# EAGLE schematic RoboDiscovery-F4_V1.0 (EAGLE 6.5.0)

## Sheet 1 of 6
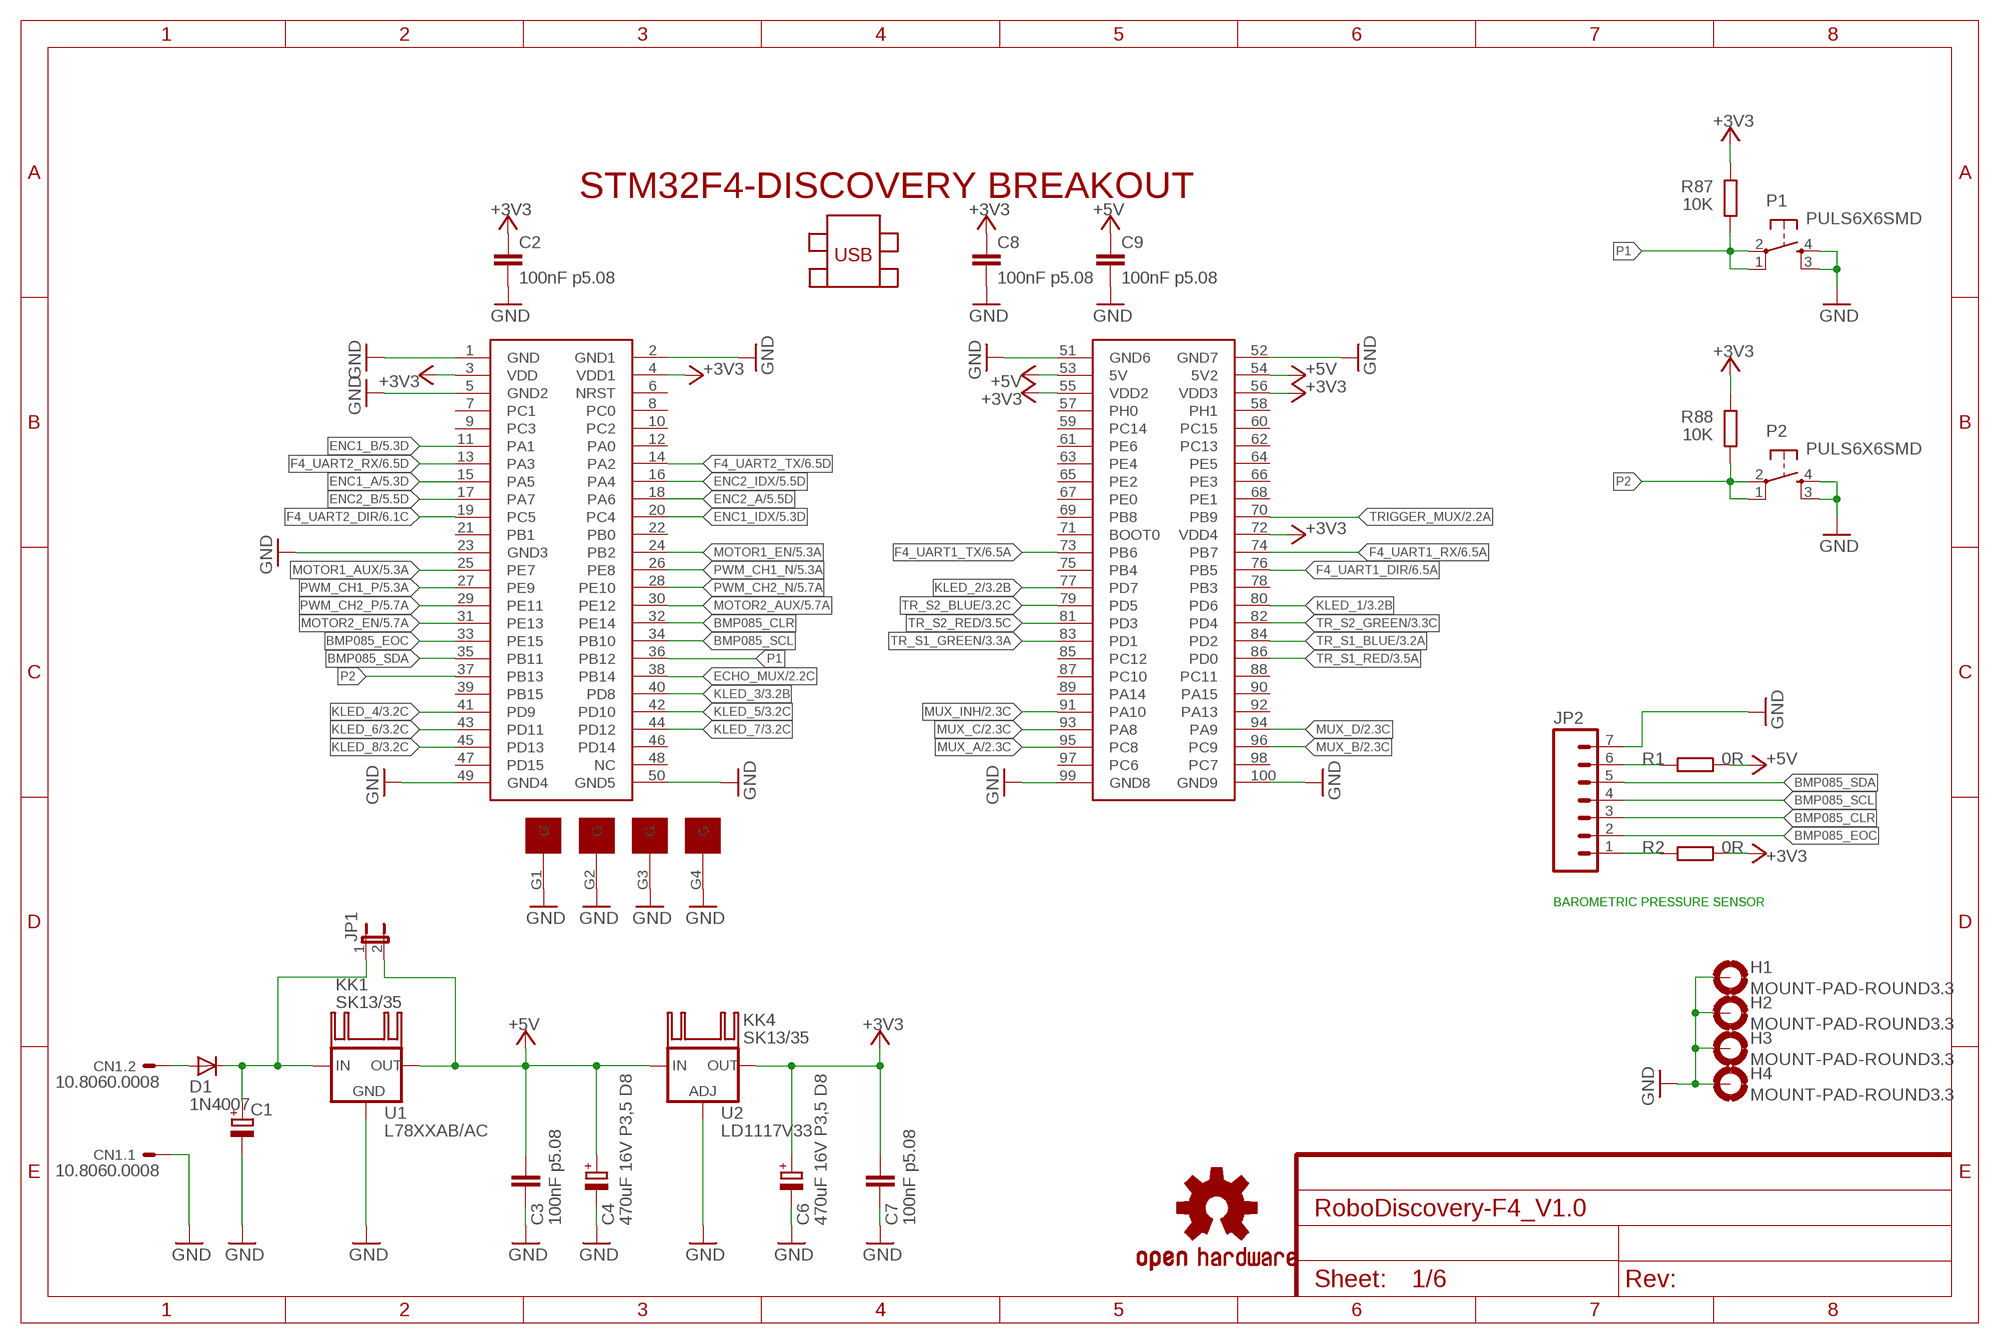
[diagram p0: schematic, sheet 1]
FRAME1 (FRAME-A4L): CNAME: CPU; CREVISION: 0.1; DESIGNER: Mauro Soligo

### Parts
C1  CPOL-EUE5-13  [E5-13]
C2  100nF p5.08  C-EU050-024X044  [C050-024X044]
C3  100nF p5.08  C-EU050-024X044  [C050-024X044]
C4  470uF 16V P3,5 D8  CPOL-EUE3.5-8  [E3,5-8]
C6  470uF 16V P3,5 D8  CPOL-EUE3.5-8  [E3,5-8]
C7  100nF p5.08  C-EU050-024X044  [C050-024X044]
C8  100nF p5.08  C-EU050-024X044  [C050-024X044]
C9  100nF p5.08  C-EU050-024X044  [C050-024X044]
CN1  10.8060.0008  [300-021-13_2P/5VE]
D1  1N4007  [D041-10]
DIS1  STM32F4-DISCOVERY  [STM32F4-DISCOVERY]
H1  MOUNT-PAD-ROUND3.3  [3,3-PAD]
H2  MOUNT-PAD-ROUND3.3  [3,3-PAD]
H3  MOUNT-PAD-ROUND3.3  [3,3-PAD]
H4  MOUNT-PAD-ROUND3.3  [3,3-PAD]
JP1  JP1E  [JP1]
JP2  M07LONGPADS  [1X07_LONGPADS]
KK1  SK13/35  [SK13/35]
KK4  SK13/35  [SK13/35]
LOGO1  OSHW-LOGOM  [OSHW-LOGO-M]
P1  PULS6X6SMD  [PULS6X6SMD]
P2  PULS6X6SMD  [PULS6X6SMD]
R1  0R  R-EU_0207/7  [0207/7]
R2  0R  R-EU_0207/7  [0207/7]
R87  10K  R-EU_0207/7  [0207/7]
R88  10K  R-EU_0207/7  [0207/7]
U1  L78XXAB/AC  [78XXL]
U2  LD1117V33  LM317TL  [317TL]

### Nets
+3V3: C2.1 C6.+ C7.1 C8.1 DIS1.3(VDD) DIS1.4(VDD1) DIS1.55(VDD2) DIS1.56(VDD3) DIS1.72(VDD4) R2.1 R87.1 R88.1 U2.2(OUT) ; also sheet 5,6
+5V: C3.1 C4.+ C9.1 DIS1.53(5V) DIS1.54(5V2) JP1.2 R1.1 U1.OUT U2.3(IN) ; also sheet 2,5,6
BMP085_CLR: DIS1.32(PE14) JP2.3
BMP085_EOC: DIS1.33(PE15) JP2.2
BMP085_SCL: DIS1.34(PB10) JP2.4
BMP085_SDA: DIS1.35(PB11) JP2.5
ECHO_MUX: DIS1.38(PB14) ; also sheet 2,4
ENC1_A: DIS1.15(PA5) ; also sheet 5
ENC1_B: DIS1.11(PA1) ; also sheet 5
ENC1_IDX: DIS1.20(PC4) ; also sheet 5
ENC2_A: DIS1.18(PA6) ; also sheet 5
ENC2_B: DIS1.17(PA7) ; also sheet 5
ENC2_IDX: DIS1.16(PA4) ; also sheet 5
F4_UART1_DIR: DIS1.76(PB5) ; also sheet 6
F4_UART1_RX: DIS1.74(PB7) ; also sheet 6
F4_UART1_TX: DIS1.73(PB6) ; also sheet 6
F4_UART2_DIR: DIS1.19(PC5) ; also sheet 6
F4_UART2_RX: DIS1.13(PA3) ; also sheet 6
F4_UART2_TX: DIS1.14(PA2) ; also sheet 6
GND: C1.- C2.2 C3.2 C4.- C6.- C7.2 C8.2 C9.2 CN1.1 DIS1.1(GND) DIS1.2(GND1) DIS1.5(GND2) DIS1.23(GND3) DIS1.49(GND4) DIS1.50(GND5) DIS1.51(GND6) DIS1.52(GND7) DIS1.99(GND8) DIS1.100(GND9) DIS1.G1(G) DIS1.G2(G) DIS1.G3(G) DIS1.G4(G) H1.B3,3(MOUNT) H2.B3,3(MOUNT) H3.B3,3(MOUNT) H4.B3,3(MOUNT) JP2.7 P1.3(S1) P1.4(S) P2.3(S1) P2.4(S) U1.GND U2.1(ADJ) ; also sheet 2,3,4,5,6
KLED_1: DIS1.80(PD6) ; also sheet 3
KLED_2: DIS1.77(PD7) ; also sheet 3
KLED_3: DIS1.40(PD8) ; also sheet 3
KLED_4: DIS1.41(PD9) ; also sheet 3
KLED_5: DIS1.42(PD10) ; also sheet 3
KLED_6: DIS1.43(PD11) ; also sheet 3
KLED_7: DIS1.44(PD12) ; also sheet 3
KLED_8: DIS1.45(PD13) ; also sheet 3
MOTOR1_AUX: DIS1.25(PE7) ; also sheet 5
MOTOR1_EN: DIS1.24(PB2) ; also sheet 5
MOTOR2_AUX: DIS1.30(PE12) ; also sheet 5
MOTOR2_EN: DIS1.31(PE13) ; also sheet 5
MUX_A: DIS1.95(PC8) ; also sheet 2,4
MUX_B: DIS1.96(PC9) ; also sheet 2,4
MUX_C: DIS1.93(PA8) ; also sheet 2,4
MUX_D: DIS1.94(PA9) ; also sheet 2,4
MUX_INH: DIS1.91(PA10) ; also sheet 2,4
N$71: C1.+ D1.C JP1.1 U1.IN
N$73: JP2.6 R1.2
N$74: JP2.1 R2.2
N$102: CN1.2 D1.A
P1: DIS1.36(PB12) P1.1 P1.2(P) R87.2
P2: DIS1.37(PB13) P2.1 P2.2(P) R88.2
PWM_CH1_N: DIS1.26(PE8) ; also sheet 5
PWM_CH1_P: DIS1.27(PE9) ; also sheet 5
PWM_CH2_N: DIS1.28(PE10) ; also sheet 5
PWM_CH2_P: DIS1.29(PE11) ; also sheet 5
TR_S1_BLUE: DIS1.84(PD2) ; also sheet 3
TR_S1_GREEN: DIS1.83(PD1) ; also sheet 3
TR_S1_RED: DIS1.86(PD0) ; also sheet 3
TR_S2_BLUE: DIS1.79(PD5) ; also sheet 3
TR_S2_GREEN: DIS1.82(PD4) ; also sheet 3
TR_S2_RED: DIS1.81(PD3) ; also sheet 3
TRIGGER_MUX: DIS1.70(PB9) ; also sheet 2,4
Unconnected: DIS1.6(NRST) DIS1.7(PC1) DIS1.8(PC0) DIS1.9(PC3) DIS1.10(PC2) DIS1.12(PA0) DIS1.21(PB1) DIS1.22(PB0) DIS1.39(PB15) DIS1.46(PD14) DIS1.47(PD15) DIS1.48(NC) DIS1.57(PH0) DIS1.58(PH1) DIS1.59(PC14) DIS1.60(PC15) DIS1.61(PE6) DIS1.62(PC13) DIS1.63(PE4) DIS1.64(PE5) DIS1.65(PE2) DIS1.66(PE3) DIS1.67(PE0) DIS1.68(PE1) DIS1.69(PB8) DIS1.71(BOOT0) DIS1.75(PB4) DIS1.78(PB3) DIS1.85(PC12) DIS1.87(PC10) DIS1.88(PC11) DIS1.89(PA14) DIS1.90(PA15) DIS1.92(PA13) DIS1.97(PC6) DIS1.98(PC7)

### Notes on the sheet
- BAROMETRIC PRESSURE SENSOR

## Sheet 2 of 6
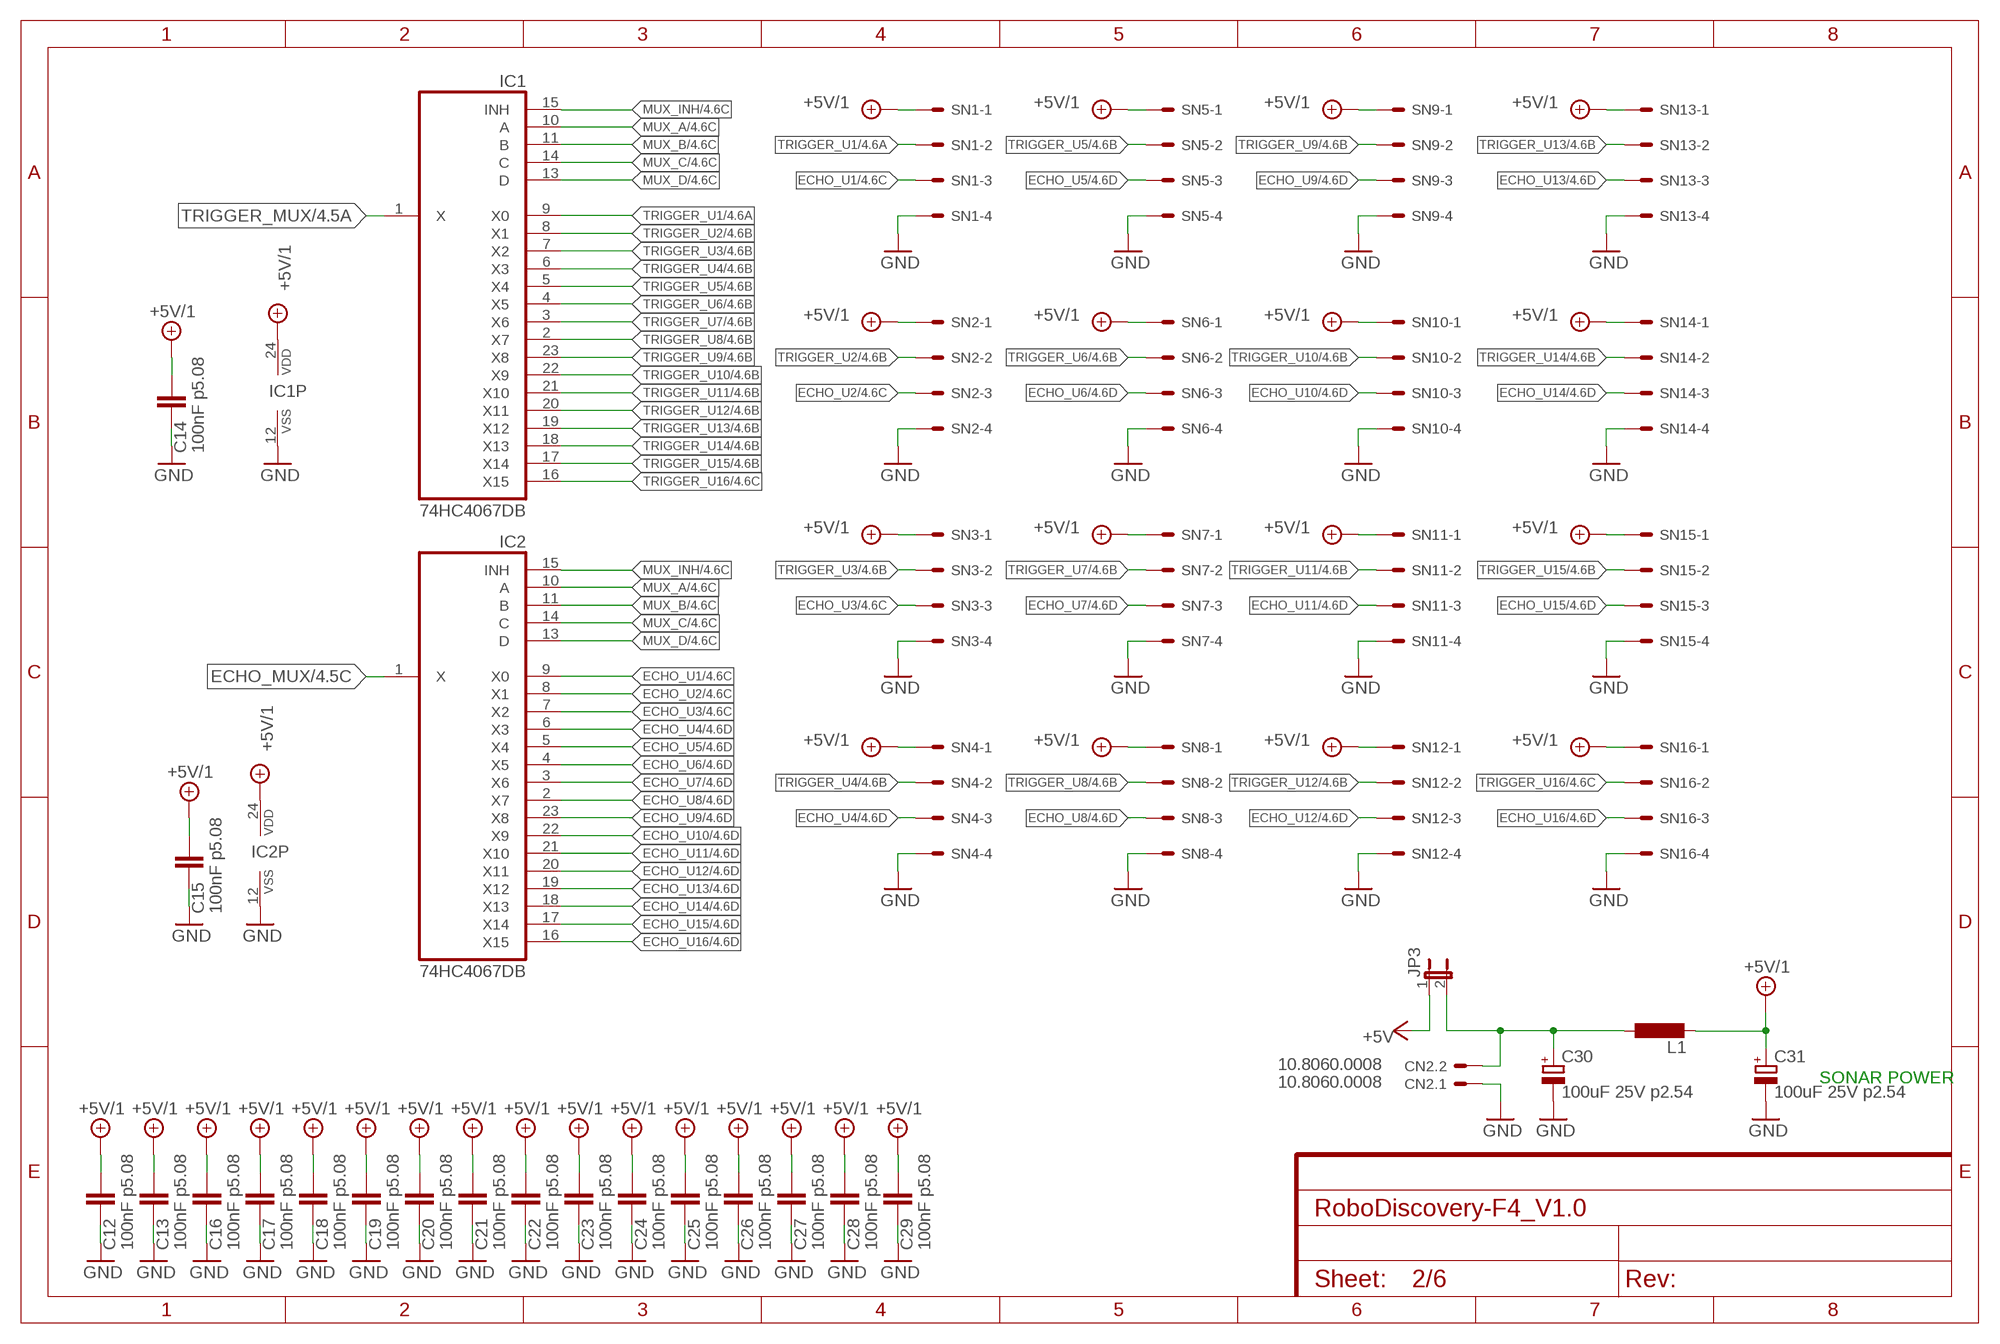
[diagram p1: schematic, sheet 2]
FRAME2 (FRAME-A4L): CNAME: SONAR MUX

### Parts
C12  100nF p5.08  C-EU050-024X044  [C050-024X044]
C13  100nF p5.08  C-EU050-024X044  [C050-024X044]
C14  100nF p5.08  C-EU050-024X044  [C050-024X044]
C15  100nF p5.08  C-EU050-024X044  [C050-024X044]
C16  100nF p5.08  C-EU050-024X044  [C050-024X044]
C17  100nF p5.08  C-EU050-024X044  [C050-024X044]
C18  100nF p5.08  C-EU050-024X044  [C050-024X044]
C19  100nF p5.08  C-EU050-024X044  [C050-024X044]
C20  100nF p5.08  C-EU050-024X044  [C050-024X044]
C21  100nF p5.08  C-EU050-024X044  [C050-024X044]
C22  100nF p5.08  C-EU050-024X044  [C050-024X044]
C23  100nF p5.08  C-EU050-024X044  [C050-024X044]
C24  100nF p5.08  C-EU050-024X044  [C050-024X044]
C25  100nF p5.08  C-EU050-024X044  [C050-024X044]
C26  100nF p5.08  C-EU050-024X044  [C050-024X044]
C27  100nF p5.08  C-EU050-024X044  [C050-024X044]
C28  100nF p5.08  C-EU050-024X044  [C050-024X044]
C29  100nF p5.08  C-EU050-024X044  [C050-024X044]
C30  100uF 25V p2.54  CPOL-EUE2.5-6  [E2,5-6]
C31  100uF 25V p2.54  CPOL-EUE2.5-6  [E2,5-6]
CN2  10.8060.0008  [300-021-13_2P/5VE]
IC1  74HC4067DB  4067D  [SO24W]
IC2  74HC4067DB  4067D  [SO24W]
JP3  JP1E  [JP1]
L1  L-EU2200-12.7  [2200-12.7]
SN1  22-27-2041-04  [6410-04]
SN2  22-27-2041-04  [6410-04]
SN3  22-27-2041-04  [6410-04]
SN4  22-27-2041-04  [6410-04]
SN5  22-27-2041-04  [6410-04]
SN6  22-27-2041-04  [6410-04]
SN7  22-27-2041-04  [6410-04]
SN8  22-27-2041-04  [6410-04]
SN9  22-27-2041-04  [6410-04]
SN10  22-27-2041-04  [6410-04]
SN11  22-27-2041-04  [6410-04]
SN12  22-27-2041-04  [6410-04]
SN13  22-27-2041-04  [6410-04]
SN14  22-27-2041-04  [6410-04]
SN15  22-27-2041-04  [6410-04]
SN16  22-27-2041-04  [6410-04]

### Nets
+5V: JP3.1 ; also sheet 1,5,6
+5V/1: C12.1 C13.1 C14.1 C15.1 C16.1 C17.1 C18.1 C19.1 C20.1 C21.1 C22.1 C23.1 C24.1 C25.1 C26.1 C27.1 C28.1 C29.1 C31.+ IC1.24(VDD) IC2.24(VDD) L1.2 SN1.1 SN2.1 SN3.1 SN4.1 SN5.1 SN6.1 SN7.1 SN8.1 SN9.1 SN10.1 SN11.1 SN12.1 SN13.1 SN14.1 SN15.1 SN16.1 ; also sheet 3,4,5
ECHO_MUX: IC2.1(X) ; also sheet 1,4
ECHO_U1: IC2.9(X0) SN1.3 ; also sheet 4
ECHO_U2: IC2.8(X1) SN2.3 ; also sheet 4
ECHO_U3: IC2.7(X2) SN3.3 ; also sheet 4
ECHO_U4: IC2.6(X3) SN4.3 ; also sheet 4
ECHO_U5: IC2.5(X4) SN5.3 ; also sheet 4
ECHO_U6: IC2.4(X5) SN6.3 ; also sheet 4
ECHO_U7: IC2.3(X6) SN7.3 ; also sheet 4
ECHO_U8: IC2.2(X7) SN8.3 ; also sheet 4
ECHO_U9: IC2.23(X8) SN9.3 ; also sheet 4
ECHO_U10: IC2.22(X9) SN10.3 ; also sheet 4
ECHO_U11: IC2.21(X10) SN11.3 ; also sheet 4
ECHO_U12: IC2.20(X11) SN12.3 ; also sheet 4
ECHO_U13: IC2.19(X12) SN13.3 ; also sheet 4
ECHO_U14: IC2.18(X13) SN14.3 ; also sheet 4
ECHO_U15: IC2.17(X14) SN15.3 ; also sheet 4
ECHO_U16: IC2.16(X15) SN16.3 ; also sheet 4
GND: C12.2 C13.2 C14.2 C15.2 C16.2 C17.2 C18.2 C19.2 C20.2 C21.2 C22.2 C23.2 C24.2 C25.2 C26.2 C27.2 C28.2 C29.2 C30.- C31.- CN2.1 IC1.12(VSS) IC2.12(VSS) SN1.4 SN2.4 SN3.4 SN4.4 SN5.4 SN6.4 SN7.4 SN8.4 SN9.4 SN10.4 SN11.4 SN12.4 SN13.4 SN14.4 SN15.4 SN16.4 ; also sheet 1,3,4,5,6
MUX_A: IC1.10(A) IC2.10(A) ; also sheet 1,4
MUX_B: IC1.11(B) IC2.11(B) ; also sheet 1,4
MUX_C: IC1.14(C) IC2.14(C) ; also sheet 1,4
MUX_D: IC1.13(D) IC2.13(D) ; also sheet 1,4
MUX_INH: IC1.15(INH) IC2.15(INH) ; also sheet 1,4
N$1: C30.+ CN2.2 JP3.2 L1.1
TRIGGER_MUX: IC1.1(X) ; also sheet 1,4
TRIGGER_U1: IC1.9(X0) SN1.2 ; also sheet 4
TRIGGER_U2: IC1.8(X1) SN2.2 ; also sheet 4
TRIGGER_U3: IC1.7(X2) SN3.2 ; also sheet 4
TRIGGER_U4: IC1.6(X3) SN4.2 ; also sheet 4
TRIGGER_U5: IC1.5(X4) SN5.2 ; also sheet 4
TRIGGER_U6: IC1.4(X5) SN6.2 ; also sheet 4
TRIGGER_U7: IC1.3(X6) SN7.2 ; also sheet 4
TRIGGER_U8: IC1.2(X7) SN8.2 ; also sheet 4
TRIGGER_U9: IC1.23(X8) SN9.2 ; also sheet 4
TRIGGER_U10: IC1.22(X9) SN10.2 ; also sheet 4
TRIGGER_U11: IC1.21(X10) SN11.2 ; also sheet 4
TRIGGER_U12: IC1.20(X11) SN12.2 ; also sheet 4
TRIGGER_U13: IC1.19(X12) SN13.2 ; also sheet 4
TRIGGER_U14: IC1.18(X13) SN14.2 ; also sheet 4
TRIGGER_U15: IC1.17(X14) SN15.2 ; also sheet 4
TRIGGER_U16: IC1.16(X15) SN16.2 ; also sheet 4

### Notes on the sheet
- SONAR POWER

## Sheet 3 of 6
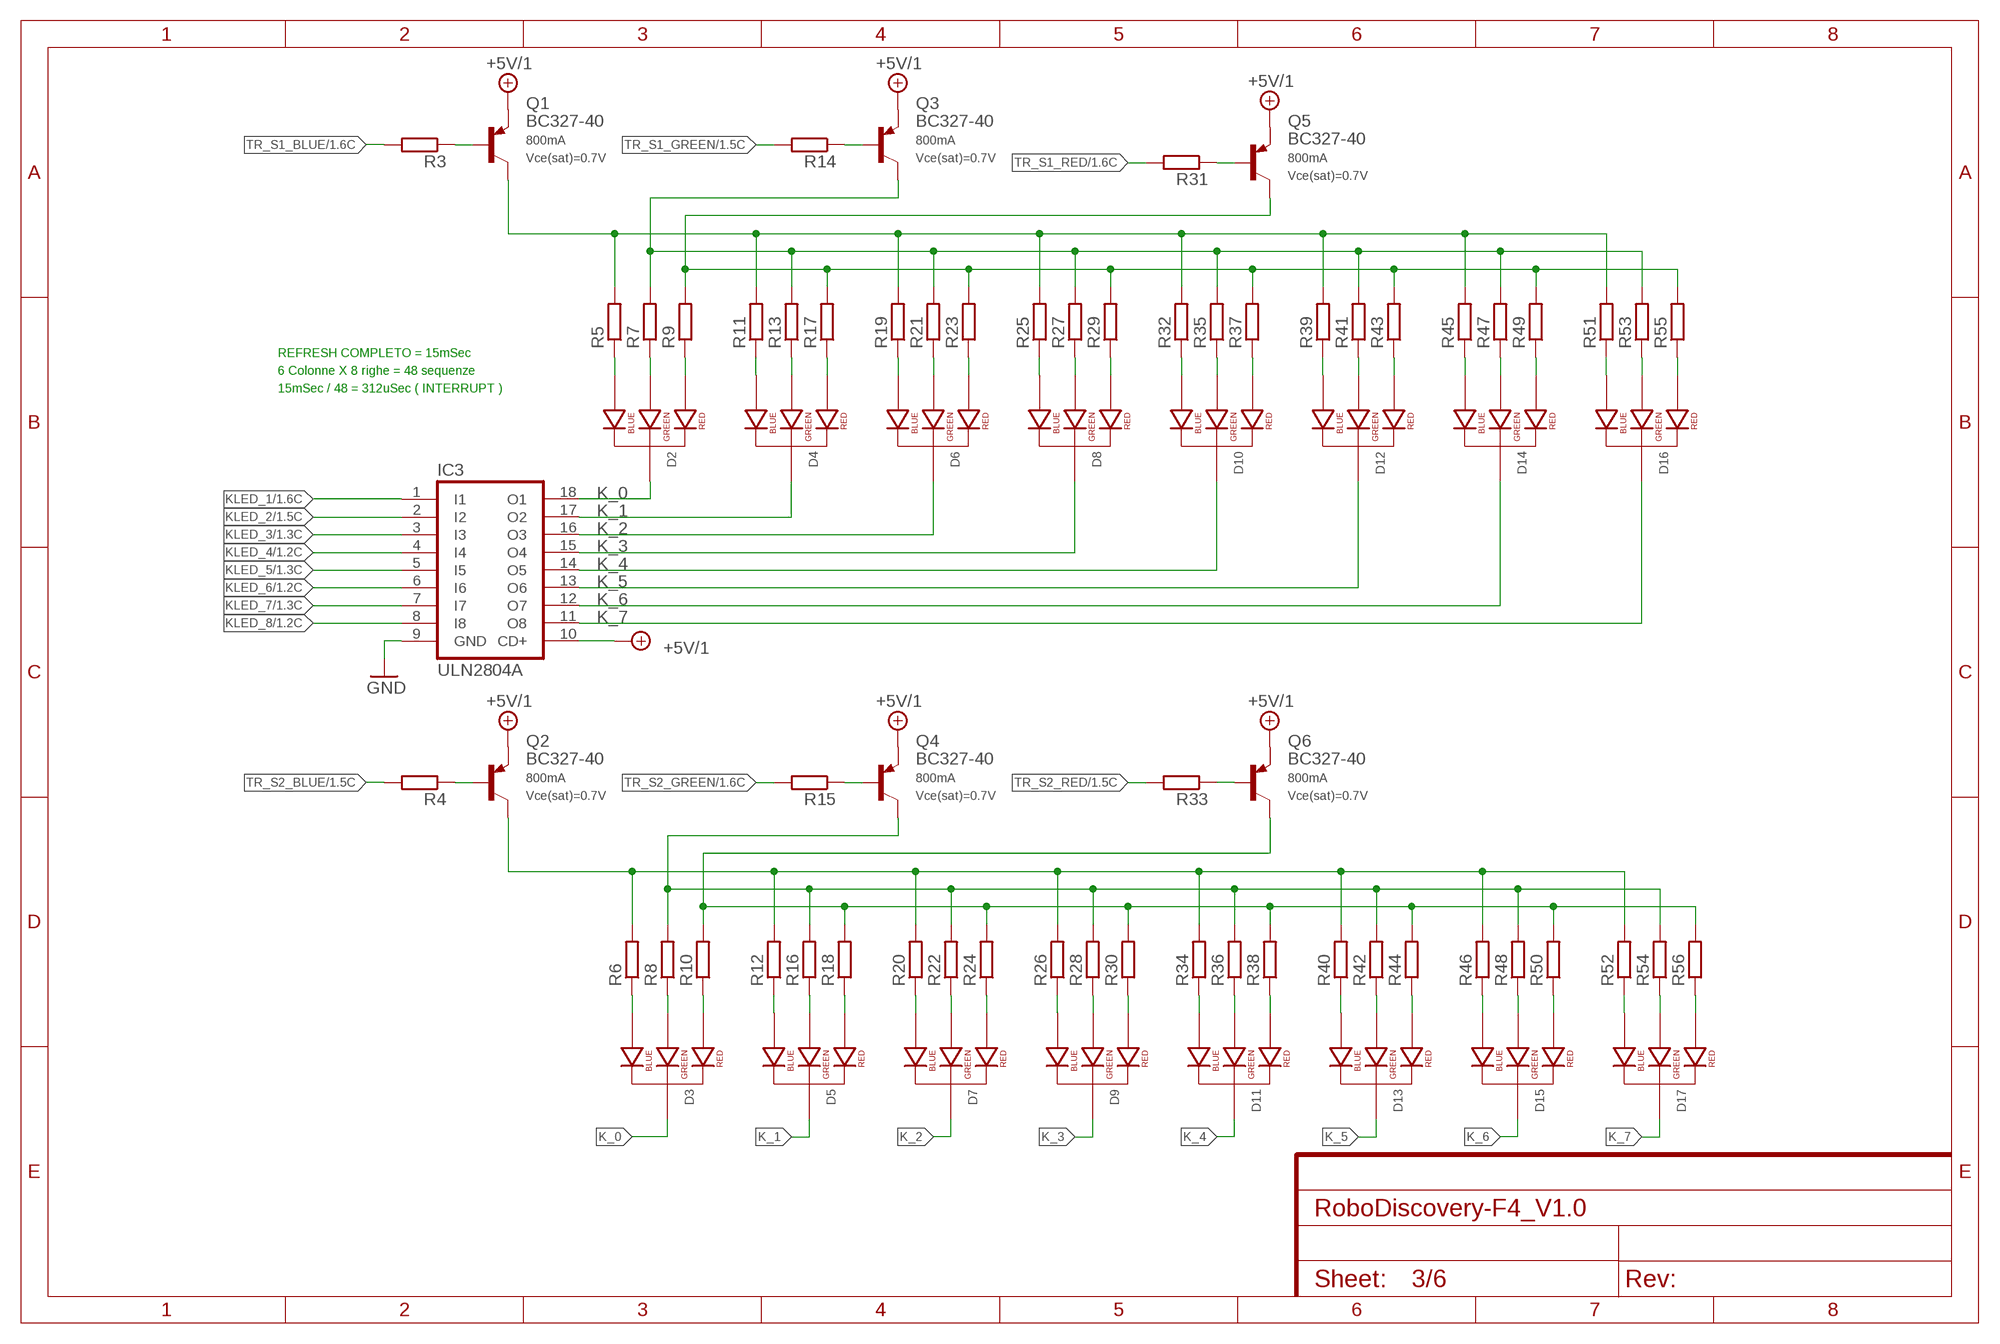
[diagram p2: schematic, sheet 3]
FRAME3 (FRAME-A4L): CNAME: LED MATRIX

### Parts
D2  LED-RGB-CC-THRUDIFFUSE  [LED-RGB-THRU]
D3  LED-RGB-CC-THRUDIFFUSE  [LED-RGB-THRU]
D4  LED-RGB-CC-THRUDIFFUSE  [LED-RGB-THRU]
D5  LED-RGB-CC-THRUDIFFUSE  [LED-RGB-THRU]
D6  LED-RGB-CC-THRUDIFFUSE  [LED-RGB-THRU]
D7  LED-RGB-CC-THRUDIFFUSE  [LED-RGB-THRU]
D8  LED-RGB-CC-THRUDIFFUSE  [LED-RGB-THRU]
D9  LED-RGB-CC-THRUDIFFUSE  [LED-RGB-THRU]
D10  LED-RGB-CC-THRUDIFFUSE  [LED-RGB-THRU]
D11  LED-RGB-CC-THRUDIFFUSE  [LED-RGB-THRU]
D12  LED-RGB-CC-THRUDIFFUSE  [LED-RGB-THRU]
D13  LED-RGB-CC-THRUDIFFUSE  [LED-RGB-THRU]
D14  LED-RGB-CC-THRUDIFFUSE  [LED-RGB-THRU]
D15  LED-RGB-CC-THRUDIFFUSE  [LED-RGB-THRU]
D16  LED-RGB-CC-THRUDIFFUSE  [LED-RGB-THRU]
D17  LED-RGB-CC-THRUDIFFUSE  [LED-RGB-THRU]
IC3  ULN2804A  [DIL18]
Q1  BC327-40  [TO92-EBC]
Q2  BC327-40  [TO92-EBC]
Q3  BC327-40  [TO92-EBC]
Q4  BC327-40  [TO92-EBC]
Q5  BC327-40  [TO92-EBC]
Q6  BC327-40  [TO92-EBC]
R3  R-EU_0207/7  [0207/7]
R4  R-EU_0207/7  [0207/7]
R5  R-EU_0207/7  [0207/7]
R6  R-EU_0207/7  [0207/7]
R7  R-EU_0207/7  [0207/7]
R8  R-EU_0207/7  [0207/7]
R9  R-EU_0207/7  [0207/7]
R10  R-EU_0207/7  [0207/7]
R11  R-EU_0207/7  [0207/7]
R12  R-EU_0207/7  [0207/7]
R13  R-EU_0207/7  [0207/7]
R14  R-EU_0207/7  [0207/7]
R15  R-EU_0207/7  [0207/7]
R16  R-EU_0207/7  [0207/7]
R17  R-EU_0207/7  [0207/7]
R18  R-EU_0207/7  [0207/7]
R19  R-EU_0207/7  [0207/7]
R20  R-EU_0207/7  [0207/7]
R21  R-EU_0207/7  [0207/7]
R22  R-EU_0207/7  [0207/7]
R23  R-EU_0207/7  [0207/7]
R24  R-EU_0207/7  [0207/7]
R25  R-EU_0207/7  [0207/7]
R26  R-EU_0207/7  [0207/7]
R27  R-EU_0207/7  [0207/7]
R28  R-EU_0207/7  [0207/7]
R29  R-EU_0207/7  [0207/7]
R30  R-EU_0207/7  [0207/7]
R31  R-EU_0207/7  [0207/7]
R32  R-EU_0207/7  [0207/7]
R33  R-EU_0207/7  [0207/7]
R34  R-EU_0207/7  [0207/7]
R35  R-EU_0207/7  [0207/7]
R36  R-EU_0207/7  [0207/7]
R37  R-EU_0207/7  [0207/7]
R38  R-EU_0207/7  [0207/7]
R39  R-EU_0207/7  [0207/7]
R40  R-EU_0207/7  [0207/7]
R41  R-EU_0207/7  [0207/7]
R42  R-EU_0207/7  [0207/7]
R43  R-EU_0207/7  [0207/7]
R44  R-EU_0207/7  [0207/7]
R45  R-EU_0207/7  [0207/7]
R46  R-EU_0207/7  [0207/7]
R47  R-EU_0207/7  [0207/7]
R48  R-EU_0207/7  [0207/7]
R49  R-EU_0207/7  [0207/7]
R50  R-EU_0207/7  [0207/7]
R51  R-EU_0207/7  [0207/7]
R52  R-EU_0207/7  [0207/7]
R53  R-EU_0207/7  [0207/7]
R54  R-EU_0207/7  [0207/7]
R55  R-EU_0207/7  [0207/7]
R56  R-EU_0207/7  [0207/7]

### Nets
+5V/1: IC3.10(CD+) Q1.E Q2.E Q3.E Q4.E Q5.E Q6.E ; also sheet 2,4,5
GND: IC3.9(GND) ; also sheet 1,2,4,5,6
K_0: D2.2(CATHODE) D3.2(CATHODE) IC3.18(O1)
K_1: D4.2(CATHODE) D5.2(CATHODE) IC3.17(O2)
K_2: D6.2(CATHODE) D7.2(CATHODE) IC3.16(O3)
K_3: D8.2(CATHODE) D9.2(CATHODE) IC3.15(O4)
K_4: D10.2(CATHODE) D11.2(CATHODE) IC3.14(O5)
K_5: D12.2(CATHODE) D13.2(CATHODE) IC3.13(O6)
K_6: D14.2(CATHODE) D15.2(CATHODE) IC3.12(O7)
K_7: D16.2(CATHODE) D17.2(CATHODE) IC3.11(O8)
KLED_1: IC3.1(I1) ; also sheet 1
KLED_2: IC3.2(I2) ; also sheet 1
KLED_3: IC3.3(I3) ; also sheet 1
KLED_4: IC3.4(I4) ; also sheet 1
KLED_5: IC3.5(I5) ; also sheet 1
KLED_6: IC3.6(I6) ; also sheet 1
KLED_7: IC3.7(I7) ; also sheet 1
KLED_8: IC3.8(I8) ; also sheet 1
N$3: Q1.C R5.2 R11.2 R19.2 R25.2 R32.2 R39.2 R45.2 R51.2
N$4: Q3.C R7.2 R13.2 R21.2 R27.2 R35.2 R41.2 R47.2 R53.2
N$5: Q5.C R9.2 R17.2 R23.2 R29.2 R37.2 R43.2 R49.2 R55.2
N$6: D2.4(BLUE_CATHODE) R5.1
N$7: D2.3(GREEN_CATHODE) R7.1
N$8: D2.1(RED_CATHODE) R9.1
N$11: D4.4(BLUE_CATHODE) R11.1
N$12: D4.3(GREEN_CATHODE) R13.1
N$13: D4.1(RED_CATHODE) R17.1
N$14: D6.4(BLUE_CATHODE) R19.1
N$15: D6.3(GREEN_CATHODE) R21.1
N$16: D6.1(RED_CATHODE) R23.1
N$17: D8.4(BLUE_CATHODE) R25.1
N$18: D8.3(GREEN_CATHODE) R27.1
N$19: D8.1(RED_CATHODE) R29.1
N$20: D10.4(BLUE_CATHODE) R32.1
N$21: D10.3(GREEN_CATHODE) R35.1
N$22: D10.1(RED_CATHODE) R37.1
N$23: D12.4(BLUE_CATHODE) R39.1
N$24: D12.3(GREEN_CATHODE) R41.1
N$25: D12.1(RED_CATHODE) R43.1
N$30: D14.4(BLUE_CATHODE) R45.1
N$31: D14.3(GREEN_CATHODE) R47.1
N$32: D14.1(RED_CATHODE) R49.1
N$33: D16.4(BLUE_CATHODE) R51.1
N$34: D16.3(GREEN_CATHODE) R53.1
N$35: D16.1(RED_CATHODE) R55.1
N$38: Q2.C R6.2 R12.2 R20.2 R26.2 R34.2 R40.2 R46.2 R52.2
N$39: Q4.C R8.2 R16.2 R22.2 R28.2 R36.2 R42.2 R48.2 R54.2
N$40: Q6.C R10.2 R18.2 R24.2 R30.2 R38.2 R44.2 R50.2 R56.2
N$41: D3.4(BLUE_CATHODE) R6.1
N$42: D3.3(GREEN_CATHODE) R8.1
N$43: D3.1(RED_CATHODE) R10.1
N$44: D5.4(BLUE_CATHODE) R12.1
N$45: D5.3(GREEN_CATHODE) R16.1
N$46: D5.1(RED_CATHODE) R18.1
N$47: D7.4(BLUE_CATHODE) R20.1
N$48: D7.3(GREEN_CATHODE) R22.1
N$49: D7.1(RED_CATHODE) R24.1
N$50: D9.4(BLUE_CATHODE) R26.1
N$51: D9.3(GREEN_CATHODE) R28.1
N$52: D9.1(RED_CATHODE) R30.1
N$53: D11.4(BLUE_CATHODE) R34.1
N$54: D11.3(GREEN_CATHODE) R36.1
N$55: D11.1(RED_CATHODE) R38.1
N$56: D13.4(BLUE_CATHODE) R40.1
N$57: D13.3(GREEN_CATHODE) R42.1
N$58: D13.1(RED_CATHODE) R44.1
N$59: D15.4(BLUE_CATHODE) R46.1
N$60: D15.3(GREEN_CATHODE) R48.1
N$61: D15.1(RED_CATHODE) R50.1
N$62: D17.4(BLUE_CATHODE) R52.1
N$63: D17.3(GREEN_CATHODE) R54.1
N$64: D17.1(RED_CATHODE) R56.1
N$65: Q1.B R3.1
N$66: Q3.B R14.1
N$67: Q5.B R31.1
N$68: Q2.B R4.1
N$69: Q4.B R15.1
N$70: Q6.B R33.1
TR_S1_BLUE: R3.2 ; also sheet 1
TR_S1_GREEN: R14.2 ; also sheet 1
TR_S1_RED: R31.2 ; also sheet 1
TR_S2_BLUE: R4.2 ; also sheet 1
TR_S2_GREEN: R15.2 ; also sheet 1
TR_S2_RED: R33.2 ; also sheet 1

### Notes on the sheet
- REFRESH COMPLETO = 15mSec
- 6 Colonne X 8 righe = 48 sequenze
- 15mSec / 48 = 312uSec ( INTERRUPT )

## Sheet 4 of 6
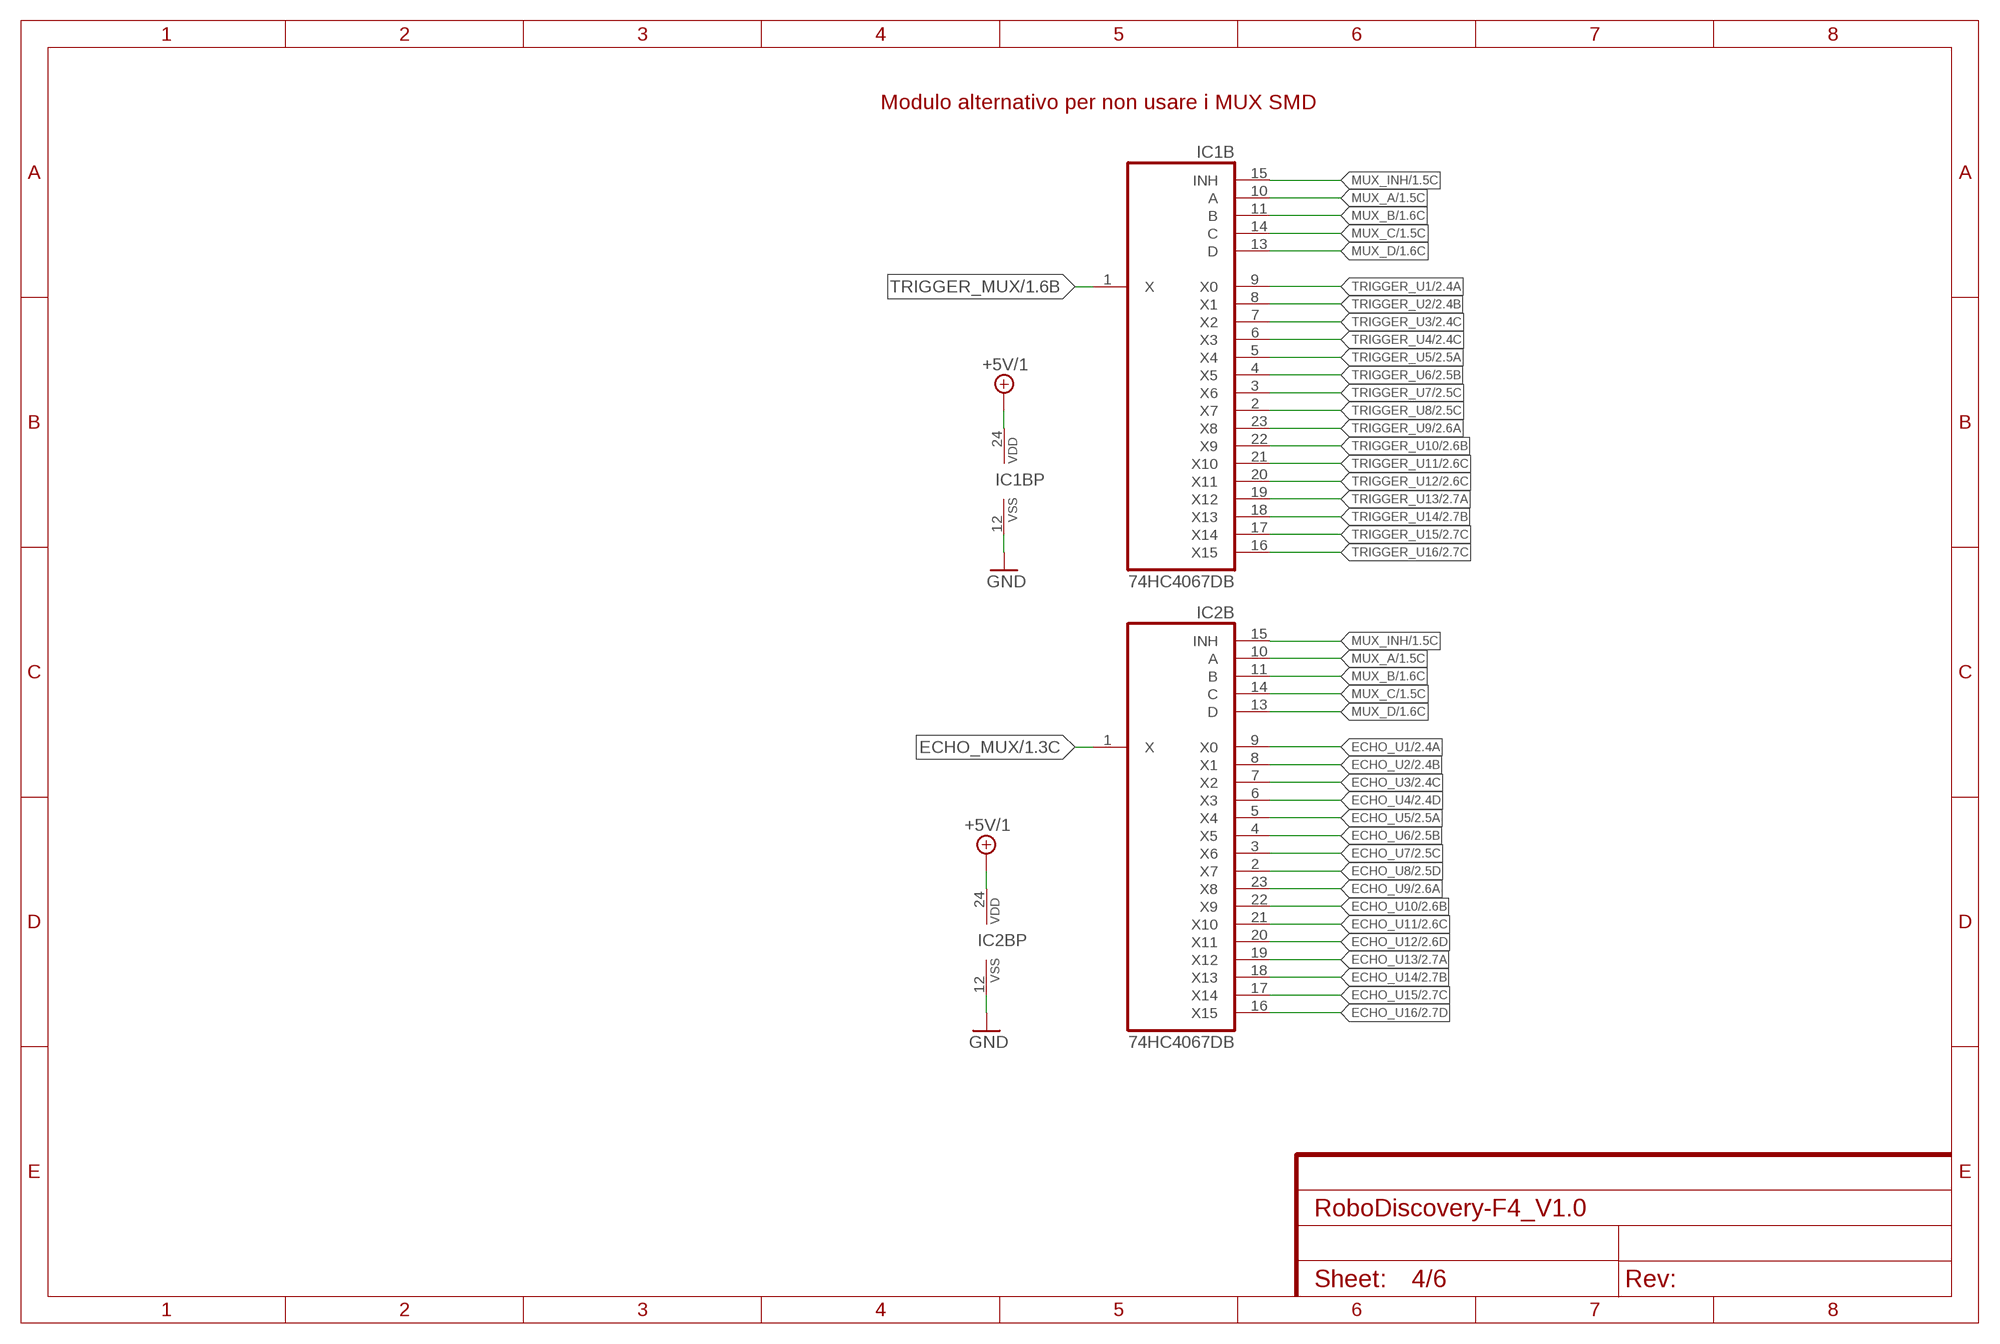
[diagram p3: schematic, sheet 4]
FRAME4 (FRAME-A4L): CNAME: Alternative Module

### Parts
IC1B  74HC4067DB  4067N  [DIL24-6]
IC2B  74HC4067DB  4067N  [DIL24-6]

### Nets
+5V/1: IC1B.24(VDD) IC2B.24(VDD) ; also sheet 2,3,5
ECHO_MUX: IC2B.1(X) ; also sheet 1,2
ECHO_U1: IC2B.9(X0) ; also sheet 2
ECHO_U2: IC2B.8(X1) ; also sheet 2
ECHO_U3: IC2B.7(X2) ; also sheet 2
ECHO_U4: IC2B.6(X3) ; also sheet 2
ECHO_U5: IC2B.5(X4) ; also sheet 2
ECHO_U6: IC2B.4(X5) ; also sheet 2
ECHO_U7: IC2B.3(X6) ; also sheet 2
ECHO_U8: IC2B.2(X7) ; also sheet 2
ECHO_U9: IC2B.23(X8) ; also sheet 2
ECHO_U10: IC2B.22(X9) ; also sheet 2
ECHO_U11: IC2B.21(X10) ; also sheet 2
ECHO_U12: IC2B.20(X11) ; also sheet 2
ECHO_U13: IC2B.19(X12) ; also sheet 2
ECHO_U14: IC2B.18(X13) ; also sheet 2
ECHO_U15: IC2B.17(X14) ; also sheet 2
ECHO_U16: IC2B.16(X15) ; also sheet 2
GND: IC1B.12(VSS) IC2B.12(VSS) ; also sheet 1,2,3,5,6
MUX_A: IC1B.10(A) IC2B.10(A) ; also sheet 1,2
MUX_B: IC1B.11(B) IC2B.11(B) ; also sheet 1,2
MUX_C: IC1B.14(C) IC2B.14(C) ; also sheet 1,2
MUX_D: IC1B.13(D) IC2B.13(D) ; also sheet 1,2
MUX_INH: IC1B.15(INH) IC2B.15(INH) ; also sheet 1,2
TRIGGER_MUX: IC1B.1(X) ; also sheet 1,2
TRIGGER_U1: IC1B.9(X0) ; also sheet 2
TRIGGER_U2: IC1B.8(X1) ; also sheet 2
TRIGGER_U3: IC1B.7(X2) ; also sheet 2
TRIGGER_U4: IC1B.6(X3) ; also sheet 2
TRIGGER_U5: IC1B.5(X4) ; also sheet 2
TRIGGER_U6: IC1B.4(X5) ; also sheet 2
TRIGGER_U7: IC1B.3(X6) ; also sheet 2
TRIGGER_U8: IC1B.2(X7) ; also sheet 2
TRIGGER_U9: IC1B.23(X8) ; also sheet 2
TRIGGER_U10: IC1B.22(X9) ; also sheet 2
TRIGGER_U11: IC1B.21(X10) ; also sheet 2
TRIGGER_U12: IC1B.20(X11) ; also sheet 2
TRIGGER_U13: IC1B.19(X12) ; also sheet 2
TRIGGER_U14: IC1B.18(X13) ; also sheet 2
TRIGGER_U15: IC1B.17(X14) ; also sheet 2
TRIGGER_U16: IC1B.16(X15) ; also sheet 2

### Notes on the sheet
- Modulo alternativo per non usare i MUX SMD

## Sheet 5 of 6
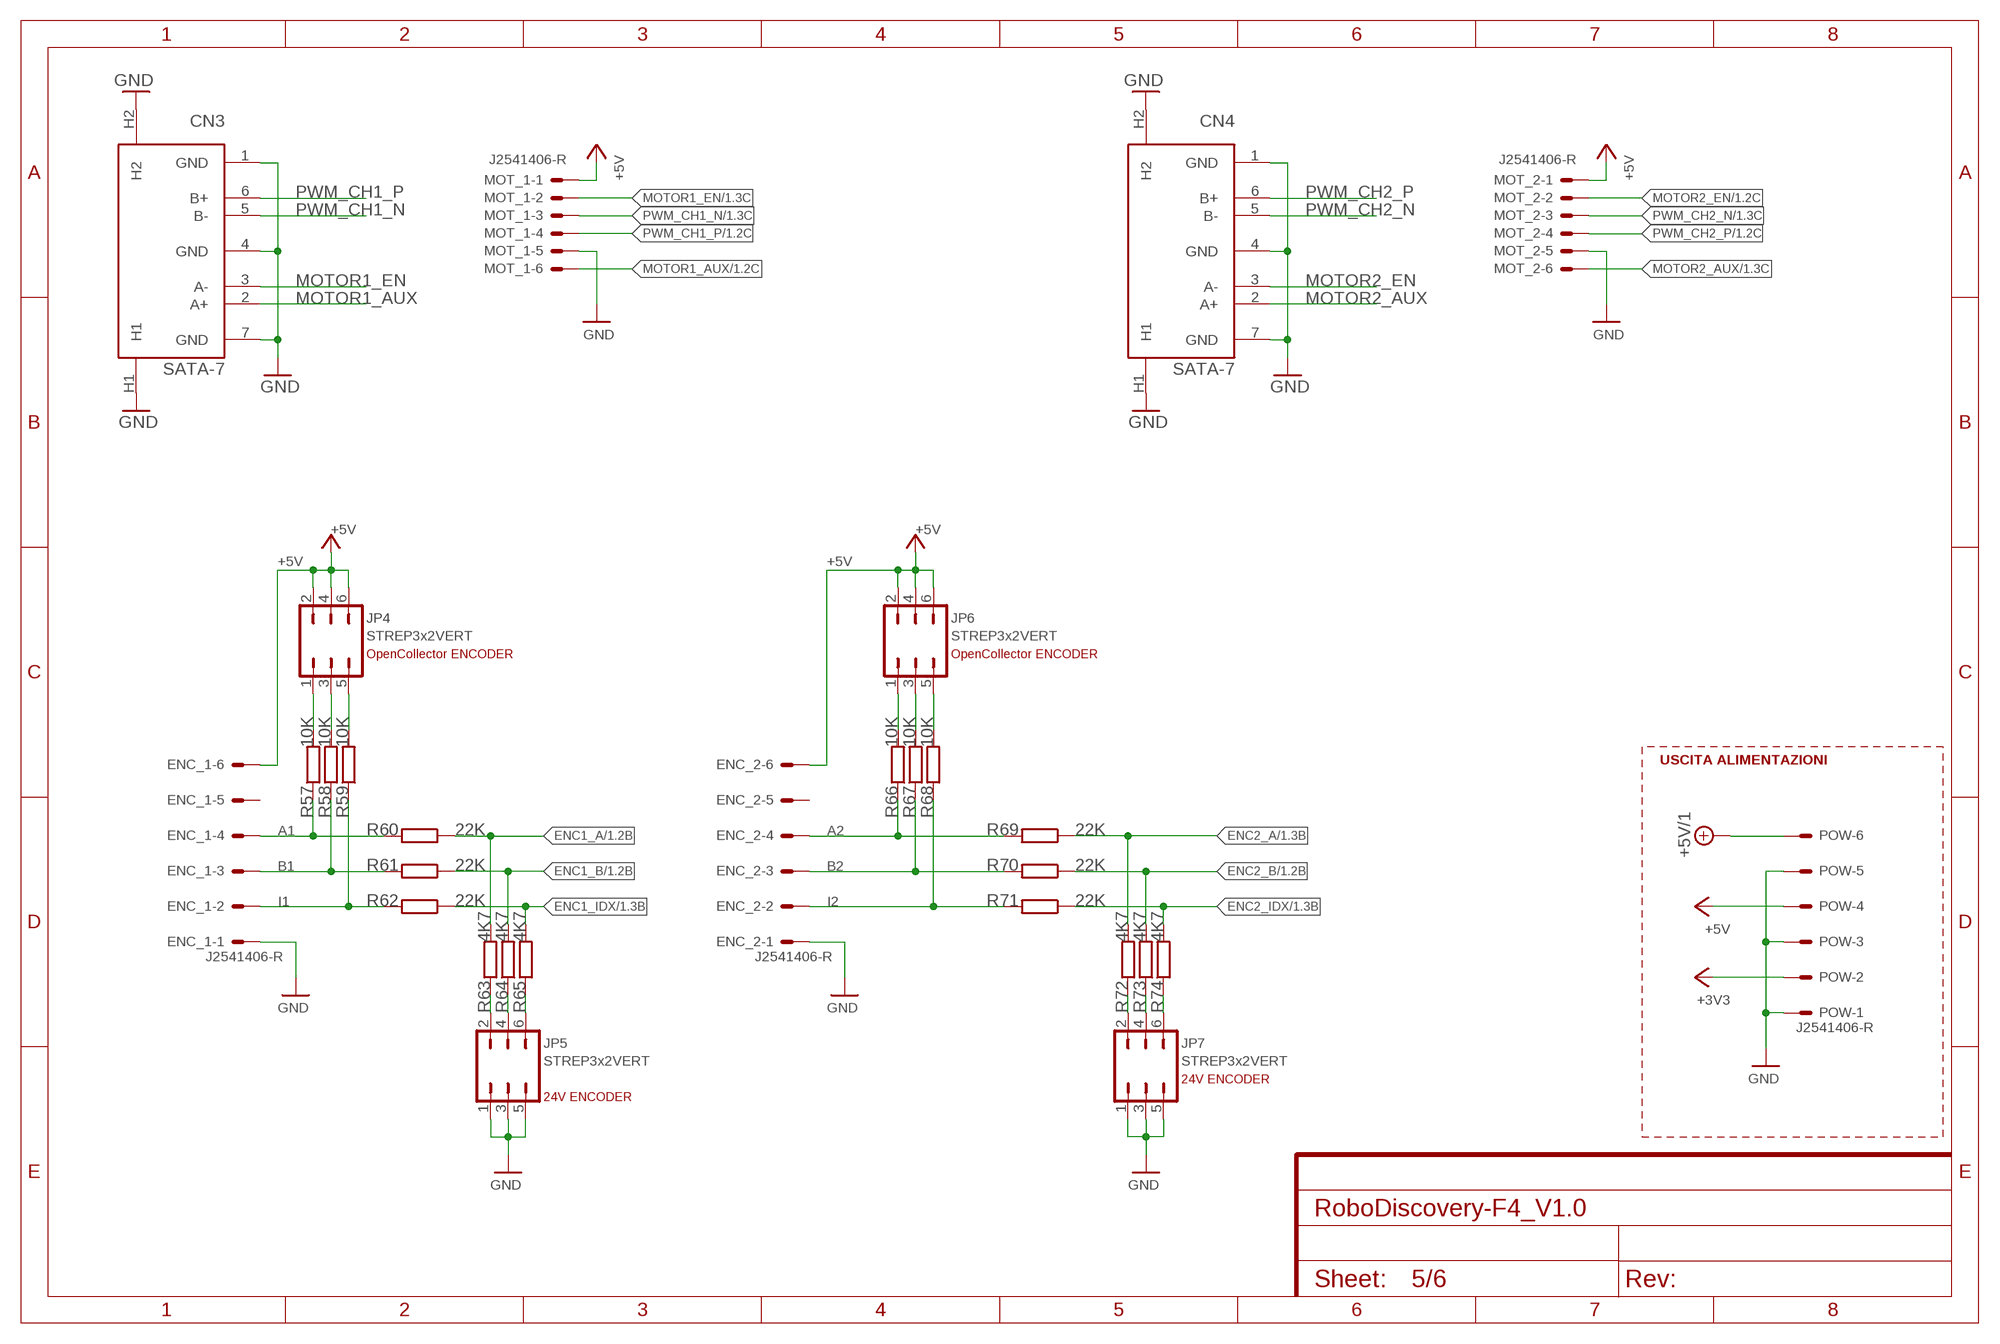
[diagram p4: schematic, sheet 5]
FRAME6 (FRAME-A4L): CNAME: Motor Interface; CREVISION: 0.1; DESIGNER: Mauro Soligo

### Parts
CN3  SATA-7  [SATA-5607-5102-SH]
CN4  SATA-7  [SATA-5607-5102-SH]
ENC_1  J2541406-R  22-27-2061-06  [6410-06]
ENC_2  J2541406-R  22-27-2061-06  [6410-06]
JP4  STREP3x2VERT  JP3Q  [JP3Q]
JP5  STREP3x2VERT  JP3Q  [JP3Q]
JP6  STREP3x2VERT  JP3Q  [JP3Q]
JP7  STREP3x2VERT  JP3Q  [JP3Q]
MOT_1  J2541406-R  22-27-2061-06  [6410-06]
MOT_2  J2541406-R  22-27-2061-06  [6410-06]
POW  J2541406-R  22-27-2061-06  [6410-06]
R57  10K  R-EU_0207/7  [0207/7]
R58  10K  R-EU_0207/7  [0207/7]
R59  10K  R-EU_0207/7  [0207/7]
R60  22K  R-EU_0207/7  [0207/7]
R61  22K  R-EU_0207/7  [0207/7]
R62  22K  R-EU_0207/7  [0207/7]
R63  4K7  R-EU_0207/7  [0207/7]
R64  4K7  R-EU_0207/7  [0207/7]
R65  4K7  R-EU_0207/7  [0207/7]
R66  10K  R-EU_0207/7  [0207/7]
R67  10K  R-EU_0207/7  [0207/7]
R68  10K  R-EU_0207/7  [0207/7]
R69  22K  R-EU_0207/7  [0207/7]
R70  22K  R-EU_0207/7  [0207/7]
R71  22K  R-EU_0207/7  [0207/7]
R72  4K7  R-EU_0207/7  [0207/7]
R73  4K7  R-EU_0207/7  [0207/7]
R74  4K7  R-EU_0207/7  [0207/7]

### Nets
+3V3: POW.2 ; also sheet 1,6
+5V: ENC_1.6 ENC_2.6 JP4.2 JP4.4 JP4.6 JP6.2 JP6.4 JP6.6 MOT_1.1 MOT_2.1 POW.4 ; also sheet 1,2,6
+5V/1: POW.6 ; also sheet 2,3,4
A1: ENC_1.4 R57.1 R60.2
A2: ENC_2.4 R66.1 R69.2
B1: ENC_1.3 R58.1 R61.2
B2: ENC_2.3 R67.1 R70.2
ENC1_A: R60.1 R63.2 ; also sheet 1
ENC1_B: R61.1 R64.2 ; also sheet 1
ENC1_IDX: R62.1 R65.2 ; also sheet 1
ENC2_A: R69.1 R72.2 ; also sheet 1
ENC2_B: R70.1 R73.2 ; also sheet 1
ENC2_IDX: R71.1 R74.2 ; also sheet 1
GND: CN3.1(GND) CN3.4(GND) CN3.7(GND) CN3.H1 CN3.H2 CN4.1(GND) CN4.4(GND) CN4.7(GND) CN4.H1 CN4.H2 ENC_1.1 ENC_2.1 JP5.1 JP5.3 JP5.5 JP7.1 JP7.3 JP7.5 MOT_1.5 MOT_2.5 POW.1 POW.3 POW.5 ; also sheet 1,2,3,4,6
I1: ENC_1.2 R59.1 R62.2
I2: ENC_2.2 R68.1 R71.2
MOTOR1_AUX: CN3.2(A+) MOT_1.6 ; also sheet 1
MOTOR1_EN: CN3.3(A-) MOT_1.2 ; also sheet 1
MOTOR2_AUX: CN4.2(A+) MOT_2.6 ; also sheet 1
MOTOR2_EN: CN4.3(A-) MOT_2.2 ; also sheet 1
N$36: JP6.3 R67.2
N$37: JP6.5 R68.2
N$75: JP6.1 R66.2
N$76: JP4.3 R58.2
N$77: JP4.5 R59.2
N$78: JP4.1 R57.2
N$93: JP5.2 R63.1
N$94: JP5.4 R64.1
N$95: JP5.6 R65.1
N$96: JP7.2 R72.1
N$99: JP7.4 R73.1
N$100: JP7.6 R74.1
PWM_CH1_N: CN3.5(B-) MOT_1.3 ; also sheet 1
PWM_CH1_P: CN3.6(B+) MOT_1.4 ; also sheet 1
PWM_CH2_N: CN4.5(B-) MOT_2.3 ; also sheet 1
PWM_CH2_P: CN4.6(B+) MOT_2.4 ; also sheet 1
Unconnected: ENC_1.5 ENC_2.5

### Notes on the sheet
- OpenCollector ENCODER | OpenCollector ENCODER
- USCITA ALIMENTAZIONI
- 24V ENCODER
- 24V ENCODER

## Sheet 6 of 6
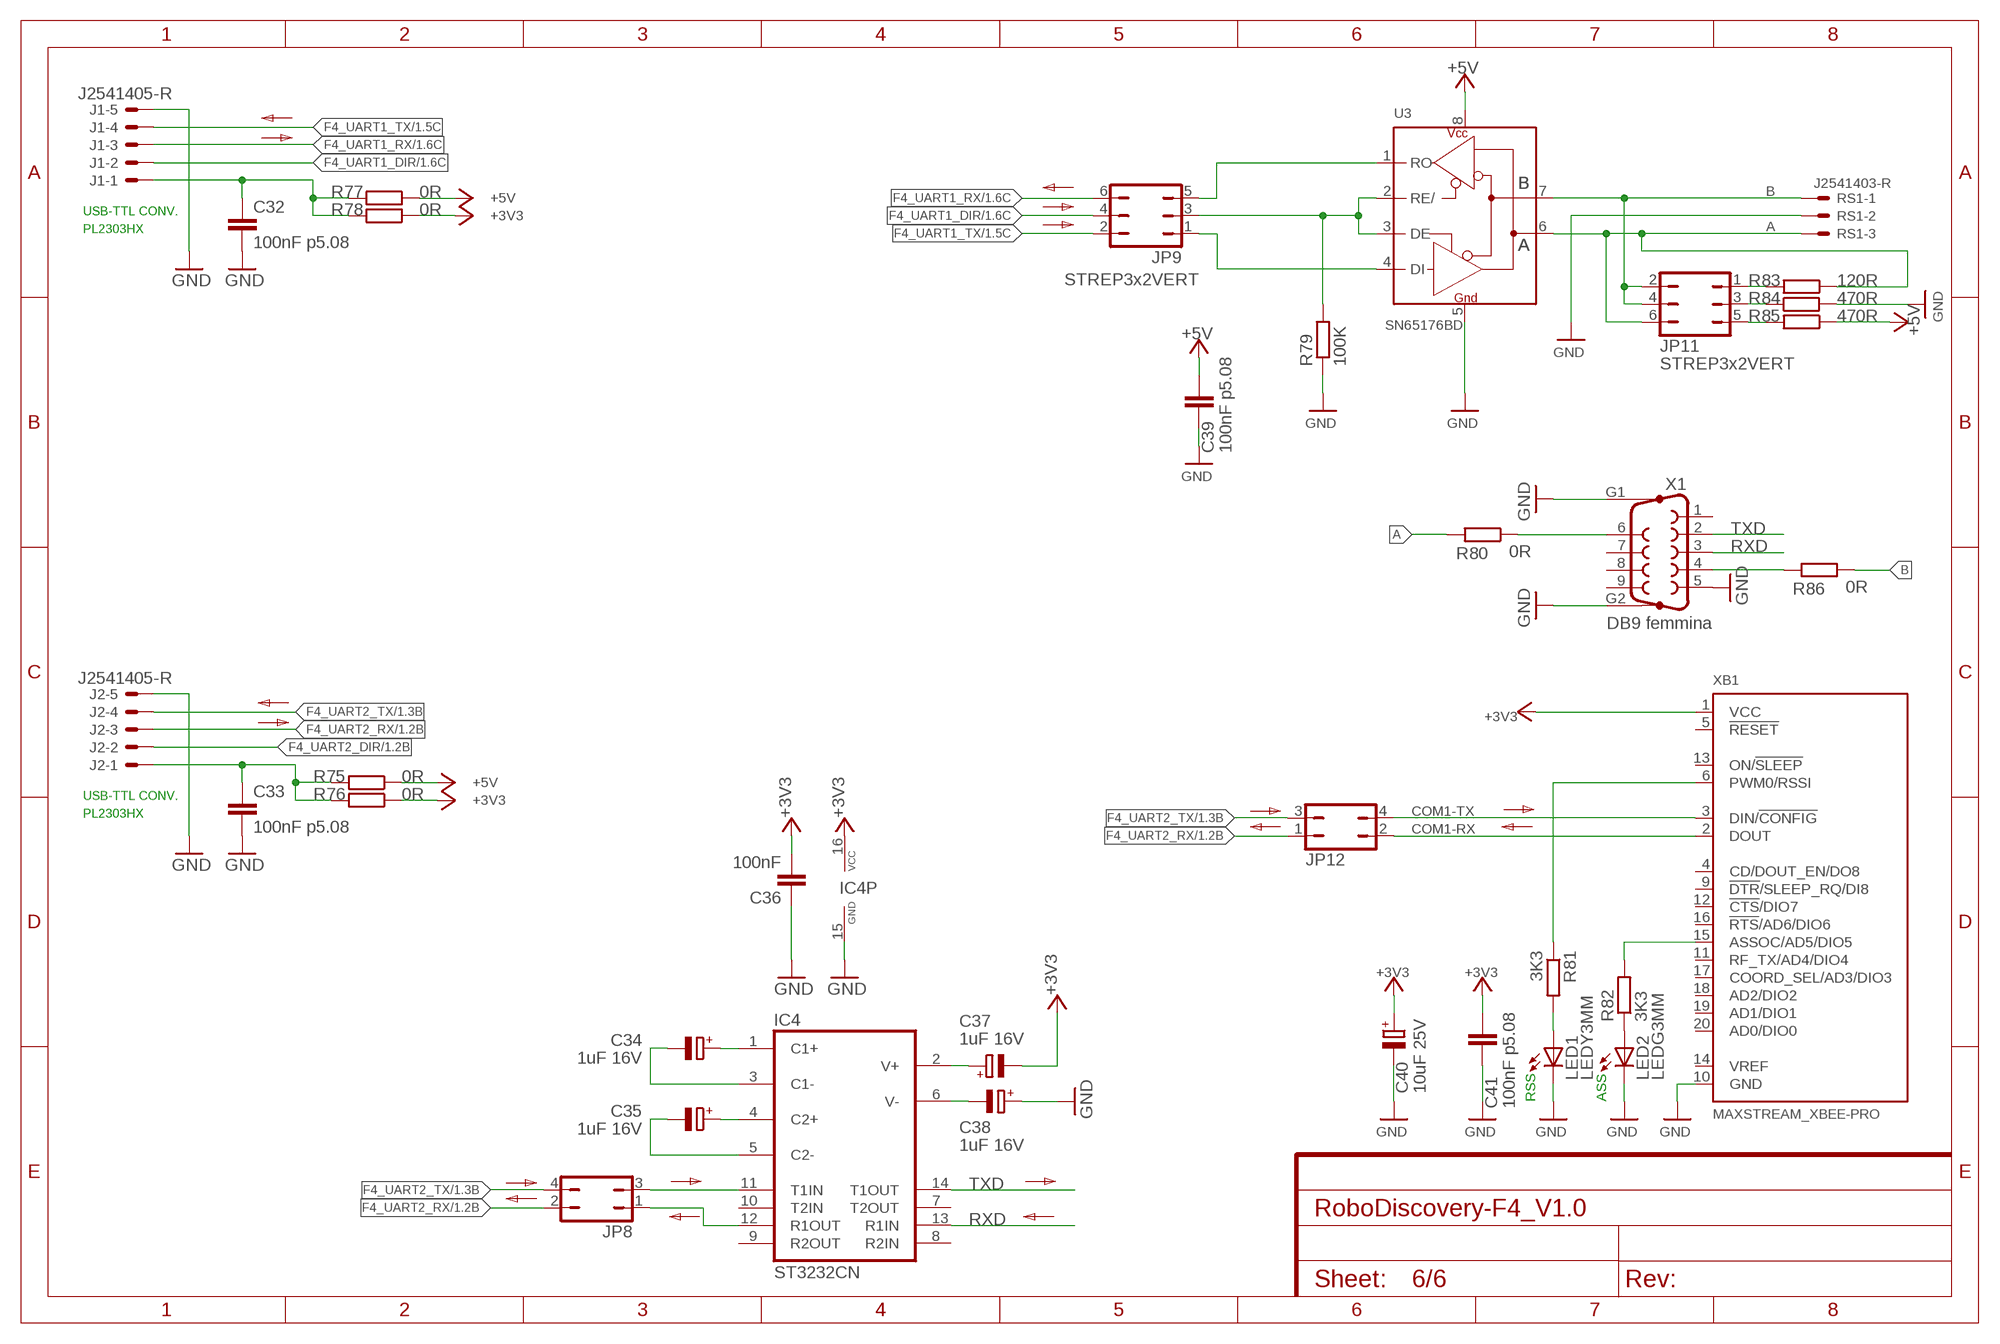
[diagram p5: schematic, sheet 6]
FRAME5 (FRAME-A4L): CNAME: COMUNICATION; CREVISION: 0.1; DESIGNER: Mauro Soligo

### Parts
C32  100nF p5.08  C-EU050-024X044  [C050-024X044]
C33  100nF p5.08  C-EU050-024X044  [C050-024X044]
C34  1uF 16V  CPOL-EUE2.5-5  [E2,5-5]
C35  1uF 16V  CPOL-EUE2.5-5  [E2,5-5]
C36  100nF  C-EU025-025X050  [C025-025X050]
C37  1uF 16V  CPOL-EUE2.5-5  [E2,5-5]
C38  1uF 16V  CPOL-EUE2.5-5  [E2,5-5]
C39  100nF p5.08  C-EU050-024X044  [C050-024X044]
C40  10uF 25V  CPOL-EUE2.5-5  [E2,5-5]
C41  100nF p5.08  C-EU050-024X044  [C050-024X044]
IC4  ST3232CN  MAX232  [DIL16]
J1  J2541405-R  22-27-2051-05  [6410-05]
J2  J2541405-R  22-27-2051-05  [6410-05]
JP8  JP2Q  [JP2Q]
JP9  STREP3x2VERT  JP3Q  [JP3Q]
JP11  STREP3x2VERT  JP3Q  [JP3Q]
JP12  JP2Q  [JP2Q]
LED1  LEDY3MM  LED3MM  [LED3MM]
LED2  LEDG3MM  LED3MM  [LED3MM]
R75  0R  R-EU_0207/7  [0207/7]
R76  0R  R-EU_0207/7  [0207/7]
R77  0R  R-EU_0207/7  [0207/7]
R78  0R  R-EU_0207/7  [0207/7]
R79  100K  R-EU_0207/7  [0207/7]
R80  0R  R-EU_0207/7  [0207/7]
R81  3K3  R-EU_0207/7  [0207/7]
R82  3K3  R-EU_0207/7  [0207/7]
R83  120R  R-EU_0207/7  [0207/7]
R84  470R  R-EU_0207/7  [0207/7]
R85  470R  R-EU_0207/7  [0207/7]
R86  0R  R-EU_0207/7  [0207/7]
RS1  J2541403-R  22-27-2031-03  [6410-03]
U3  SN65176BD  MAX485_DIP  [DIL8]
X1  DB9 femmina  F09HP  [F09HP]
XB1  MAXSTREAM_XBEE-PRO  [MAXSTREAM_XBEE-PRO]

### Nets
+3V3: C36.2 C37.- C40.+ C41.1 IC4.16(VCC) R76.1 R78.1 XB1.1(VCC) ; also sheet 1,5
+5V: C39.1 R75.1 R77.1 R85.1 U3.8(VCC) ; also sheet 1,2,5
A: JP11.6 R80.2 R83.1 RS1.3 U3.6(A)
B: JP11.2 JP11.4 R86.1 RS1.1 U3.7(B)
COM1-RX: JP12.2 XB1.2(DOUT)
COM1-TX: JP12.4 XB1.3(DIN/!CONFIG)
F4_UART1_DIR: J1.2 JP9.4 ; also sheet 1
F4_UART1_RX: J1.3 JP9.6 ; also sheet 1
F4_UART1_TX: J1.4 JP9.2 ; also sheet 1
F4_UART2_DIR: J2.2 ; also sheet 1
F4_UART2_RX: J2.3 JP8.2 JP12.1 ; also sheet 1
F4_UART2_TX: J2.4 JP8.4 JP12.3 ; also sheet 1
GND: C32.2 C33.2 C36.1 C38.+ C39.2 C40.- C41.2 IC4.15(GND) J1.5 J2.5 LED1.K(C) LED2.K(C) R79.1 R84.2 RS1.2 U3.5(GND) X1.5 X1.G1 X1.G2 XB1.10(GND) ; also sheet 1,2,3,4,5
N$2: C33.1 J2.1 R75.2 R76.2
N$9: R82.2 XB1.15(ASSOC/AD5/DIO5)
N$10: LED2.A R82.1
N$26: LED1.A R81.2
N$27: R81.1 XB1.6(PWM0/RSSI)
N$28: R80.1 X1.6
N$72: C32.1 J1.1 R77.2 R78.2
N$80: JP11.3 R84.1
N$81: JP11.5 R85.2
N$82: JP11.1 R83.2
N$83: C35.- IC4.5(C2-)
N$84: C34.- IC4.3(C1-)
N$85: C34.+ IC4.1(C1+)
N$86: C35.+ IC4.4(C2+)
N$87: C38.- IC4.6(V-)
N$88: C37.+ IC4.2(V+)
N$89: IC4.11(T1IN) JP8.3
N$91: IC4.12(R1OUT) JP8.1
N$97: JP9.5 U3.1(RO)
N$98: R86.2 X1.4
RS-DIR: JP9.3 R79.2 U3.2(RE/) U3.3(DE)
RS-TX: JP9.1 U3.4(DI)
RXD: IC4.13(R1IN) X1.3
TXD: IC4.14(T1OUT) X1.2
Unconnected: IC4.7(T2OUT) IC4.8(R2IN) IC4.9(R2OUT) IC4.10(T2IN) X1.1 X1.7 X1.8 X1.9 XB1.4(CD/DOUT_EN/DO8) XB1.5(!RESET) XB1.9(!DTR!/SLEEP_RQ/DI8) XB1.11(RF_TX/AD4/DIO4) XB1.12(!CTS!/DIO7) XB1.13(ON/!SLEEP) XB1.14(VREF) XB1.16(!RTS!/AD6/DIO6) XB1.17(COORD_SEL/AD3/DIO3) XB1.18(AD2/DIO2) XB1.19(AD1/DIO1) XB1.20(AD0/DIO0)

### Notes on the sheet
- USB-TTL CONV.
- PL2303HX
- USB-TTL CONV.
- PL2303HX
- RSS | ASS

## Library data of the parts
C1 C4 C6 C30 C31 C34 C35 C37 C38 C40 = rcl:CPOL-EU: POLARIZED CAPACITOR, European symbol
C2 C3 C7-C9 C12-C29 C32 C33 C36 C39 C41 = rcl:C-EU: CAPACITOR, European symbol
CN1 CN2 = katodo:10.8060.0008
CN3 CN4 = katodo:SATA-7
D1 = katodo:1N
D2-D17 = SparkFun-LED:LED-RGB-CC-THRU: RGB Through-hole common cathode LED SparkFun Storefront: COM-00105 (Clear) COM-09264 (Diffuse); PROD_ID: DIO-09434
DIS1 = STM32F4-DISCOVERY:STM32F4-DISCOVERY
ENC_1 ENC_2 MOT_1 MOT_2 POW = con-molex:22-?-06: CONNECTOR wire to board 2.54 mm (.1 inch) pitch header
H1-H4 = holes:MOUNT-PAD-ROUND: MOUNTING PAD, round
IC1 IC1B IC2 IC2B = 40xx:4067: 16-channel ANALOG MULTIPLEXER
IC3 = uln-udn:ULN2804A: DRIVER ARRAY
IC4 = maxim:MAX232: RS232 TRANSCEIVER; MF: MAXIM; MPN: MAX232ACPE+; OC_FARNELL: 9723773; OC_NEWARK: 68K4544
J1 J2 = con-molex:22-?-05: CONNECTOR wire to board 2.54 mm (.1 inch) pitch header
JP1 JP3 = pixsys:JP1E: JUMPER
JP2 = SparkFun-Connectors:M07: Header 7 Standard 7-pin 0.1" header. Use with straight break away headers (SKU : PRT-00116), right angle break away headers (PRT-00553), swiss pins (PRT-00743), machine pins (PRT-00117), and female headers (PRT-00115). NOTES ON THE VARIANTS LOCK and LOCK_LONGPADS... This footprint was designed to help hold the alignment of a through-hole component (i.e. 7-pin header) while soldering it into place. You may notice that each hole has been shifted either up or down by 0.005 of an inch from it's more standard position (which is usually a perfectly straight line). This slight alteration caused the pins (the squares in the middle) to touch the edges of the holes. Because they are alternating, it causes a "brace" to hold the header in place. 0.005 has proven to be the perfect amount of "off-center" position when using our standard breakaway headers. Although looks a little odd when you look at the bare footprint, once you have a header in there, the alteration is very hard to notice. Also, if you push a header all the way into place, it is covered up entirely on the bottom side. This idea of altering the position of holes to aid alignment will be further integrated into the Sparkfun Library for other footprints. It can help hold any component with 3 or more connection pins.
JP4-JP7 JP9 JP11 = jumper:JP3Q: JUMPER
JP8 JP12 = jumper:JP2Q: JUMPER
KK1 KK4 = heatsink:SK13/35: HEATSINK manufacturer Fischer/distributor Buerklin
L1 = rcl:L-EU: INDUCTOR, European symbol
LED1 LED2 = led:LED: LED OSRAM: - CHIPLED LG R971, LG N971, LY N971, LG Q971, LY Q971, LO R971, LY R971 LH N974, LH R974 LS Q976, LO Q976, LY Q976 LO Q996 - Hyper CHIPLED LW Q18S LB Q993, LB Q99A, LB R99A - SideLED LS A670, LO A670, LY A670, LG A670, LP A670 LB A673, LV A673, LT A673, LW A673 LH A674 LY A675 LS A676, LA A676, LO A676, LY A676, LW A676 LS A679, LY A679, LG A679 - Hyper Micro SIDELED® LS Y876, LA Y876, LO Y876, LY Y876 LT Y87S - SmartLED LW L88C, LW L88S LB L89C, LB L89S, LG L890 LS L89K, LO L89K, LY L89K LS L896, LA L896, LO L896, LY L896 - TOPLED LS T670, LO T670, LY T670, LG T670, LP T670 LSG T670, LSP T670, LSY T670, LOP T670, LYG T670 LG T671, LOG T671, LSG T671 LB T673, LV T673, LT T673, LW T673 LH T674 LS T676, LA T676, LO T676, LY T676, LB T676, LH T676, LSB T676, LW T676 LB T67C, LV T67C, LT T67C, LS T67K, LO T67K, LY T67K, LW E67C LS E67B, LA E67B, LO E67B, LY E67B, LB E67C, LV E67C, LT E67C LW T67C LS T679, LY T679, LG T679 LS T770, LO T770, LY T770, LG T770, LP T770 LB T773, LV T773, LT T773, LW T773 LH T774 LS E675, LA E675, LY E675, LS T675 LS T776, LA T776, LO T776, LY T776, LB T776 LHGB T686 LT T68C, LB T68C - Hyper Mini TOPLED® LB M676 - Mini TOPLED Santana® LG M470 LS M47K, LO M47K, LY M47K Source: http://www.osram.convergy.de LUXEON: - LUMILED® LXK2-PW12-R00, LXK2-PW12-S00, LXK2-PW14-U00, LXK2-PW14-V00 LXK2-PM12-R00, LXK2-PM12-S00, LXK2-PM14-U00 LXK2-PE12-Q00, LXK2-PE12-R00, LXK2-PE12-S00, LXK2-PE14-T00, LXK2-PE14-U00 LXK2-PB12-K00, LXK2-PB12-L00, LXK2-PB12-M00, LXK2-PB14-N00, LXK2-PB14-P00, LXK2-PB14-Q00 LXK2-PR12-L00, LXK2-PR12-M00, LXK2-PR14-Q00, LXK2-PR14-R00 LXK2-PD12-Q00, LXK2-PD12-R00, LXK2-PD12-S00 LXK2-PH12-R00, LXK2-PH12-S00 LXK2-PL12-P00, LXK2-PL12-Q00, LXK2-PL12-R00 Source: www.luxeon.com KINGBRIGHT: KA-3528ASYC Source: www.kingbright.com
LOGO1 = SparkFun-Aesthetics:OSHW-LOGO: Open Source Hardware Logo This logo indicates the piece of hardware it is found on incorporates a OSHW license and/or adheres to the definition of open source hardware found here: http://freedomdefined.org/OSHW
P1 P2 = Pixsys_Ut6:PULS6X6SMD
Q1-Q6 = transistor-pnp:BC327*: PNP Transistror; I: 800mA; VCES: 50V; VCESAT: Vce(sat)=0.7V
R1-R88 = rcl:R-EU_: RESISTOR, European symbol
RS1 = con-molex:22-?-03: CONNECTOR wire to board 2.54 mm (.1 inch) pitch header
SN1-SN16 = con-molex:22-?-04: CONNECTOR wire to board 2.54 mm (.1 inch) pitch header
U1 = v-reg-3:L78XX: VOLTAGE REGULATOR
U2 = v-reg-3:LM317TL: VOLTAGE REGULATOR
U3 = mauro:MAX485
X1 = con-subd:F09HP: SUB-D; OC_FARNELL: unknown; OC_NEWARK: unknown
XB1 = marco_mda:MAXSTREAM_XBEE: XBee (TM) /XBee-PRO(TM) OEM RF Modules Source: MaxStream, Inc. xbee_productmanual.pdf

## Net classes
0 default: width 0.254 mm, drill 0.508 mm